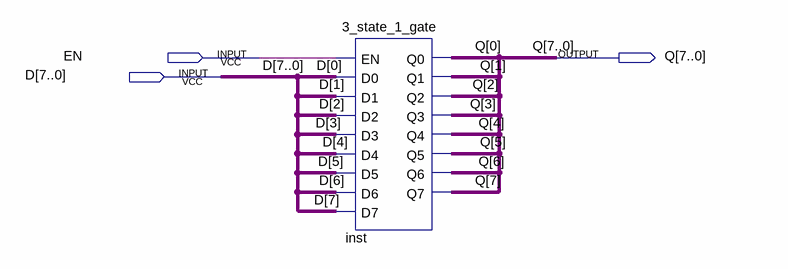
[diagram p0: schematic sheet]
// Quartus schematic 3_state_1_gate_bus.bdf as structural Verilog: 1 symbols, 3 pins
module \3_state_1_gate_bus  (
  input  EN,
  input  [7:0] D,
  output [7:0] Q
);

  \3_state_1_gate  inst (
    .EN(EN), .D0(D[0]), .D1(D[1]), .D2(D[2]), .D3(D[3]), .D4(D[4]), .D5(D[5]), .D6(D[6]), .D7(D[7]),
    .Q0(Q[0]), .Q1(Q[1]), .Q2(Q[2]), .Q3(Q[3]), .Q4(Q[4]), .Q5(Q[5]), .Q6(Q[6]), .Q7(Q[7]));
endmodule
